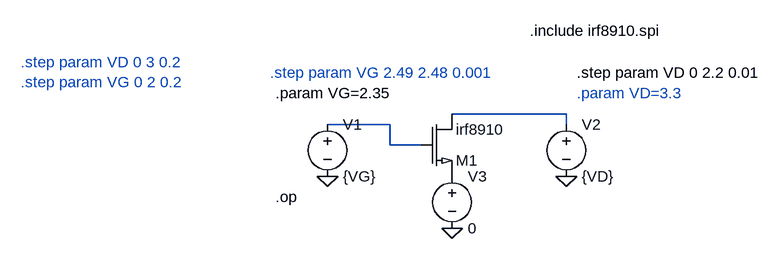
[diagram p0: schematic MOStest-irf8910.asc]
MOStest-irf8910.asc, the LTspice schematic file:
Version 4
SHEET 1 880 680
WIRE 352 128 176 128
WIRE 80 144 -16 144
WIRE 352 144 352 128
WIRE 80 176 80 144
WIRE 128 176 80 176
FLAG -16 224 0
FLAG 352 224 0
FLAG 176 304 0
SYMBOL NMOSbook 160 176 R0
SYMATTR Value irf8910
SYMATTR InstName M1
SYMBOL voltage -16 128 R0
SYMATTR InstName V1
SYMATTR Value {VG}
SYMBOL voltage 352 128 R0
SYMATTR InstName V2
SYMATTR Value {VD}
SYMBOL voltage 176 208 R0
WINDOW 123 0 0 Left 0
WINDOW 39 0 0 Left 0
SYMATTR InstName V3
SYMATTR Value 0
TEXT -488 48 Left 0 ;.step param VD 0 3 0.2\n.step param VG 0 2 0.2
TEXT -96 256 Left 0 !.op
TEXT 368 64 Left 0 !.step param VD 0 2.2 0.01
TEXT -104 64 Left 0 ;.step param VG 2.49 2.48 0.001
TEXT 368 96 Left 0 ;.param VD=3.3
TEXT 296 0 Left 0 !.include irf8910.spi
TEXT -96 96 Left 0 !.param VG=2.35

The netlist it stands for:
* MOStest-irf8910.asc
M1 N001 N002 P001 P001 irf8910
V1 N002 0 {VG}
V2 N001 0 {VD}
V3 P001 0 0
.model NMOS NMOS
.model PMOS PMOS
.lib standard.mos
* .step param VD 0 3 0.2
* .step param VG 0 2 0.2
.op
.step param VD 0 2.2 0.01
* .step param VG 2.49 2.48 0.001
* .param VD=3.3
.include irf8910.spi
.param VG=2.35
.backanno
.end